# EAGLE schematic board (EAGLE 9.5.1)
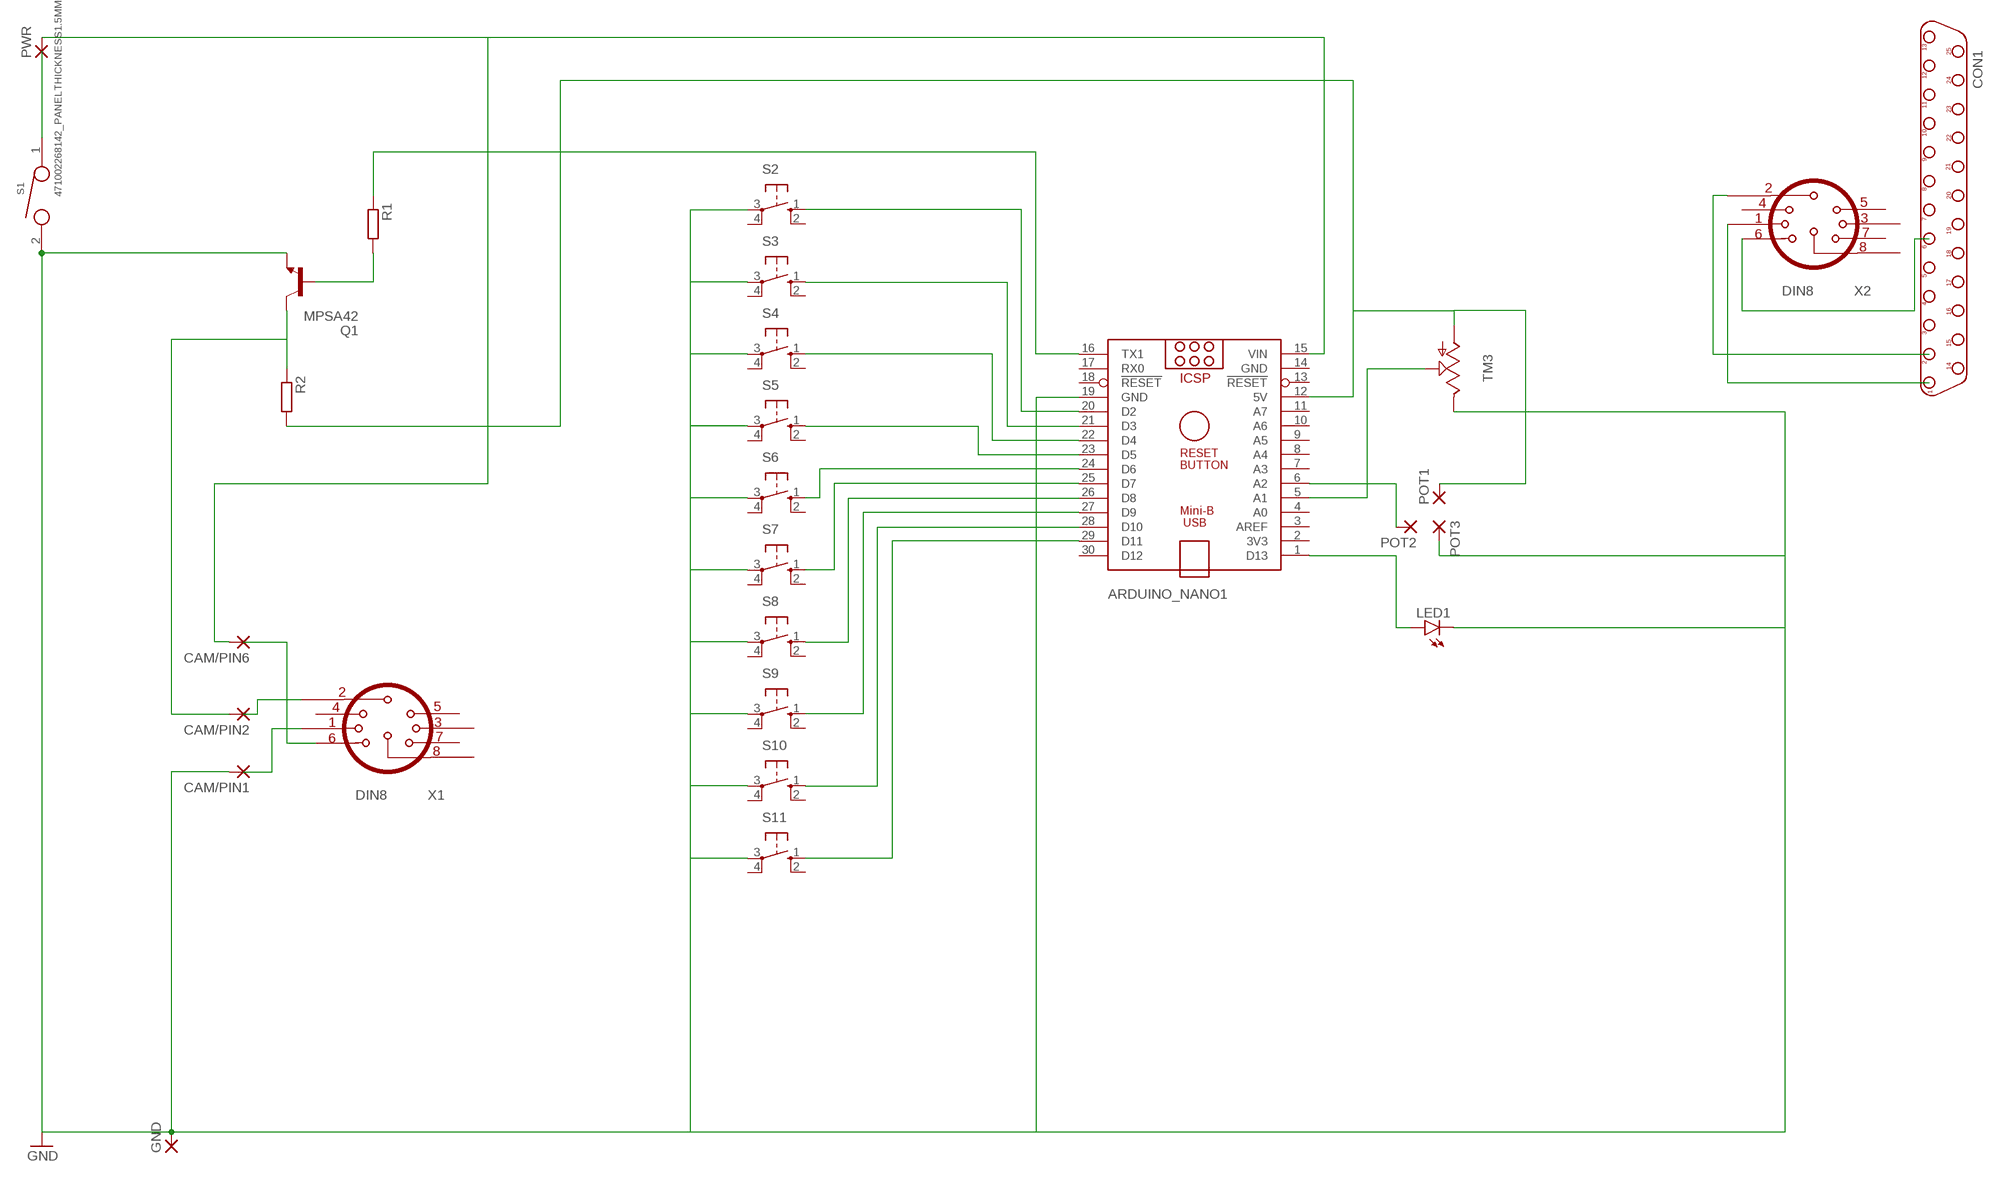
[diagram p0: schematic, sheet 1]

## Parts
ARDUINO_NANO1  ARDUINO_NANO  [ARDUINO_NANO]
CAM/PIN1  1,6/0,8  [1,6/0,8]
CAM/PIN2  1,6/0,8  [1,6/0,8]
CAM/PIN6  1,6/0,8  [1,6/0,8]
CON1  DB25F  [D-25F]
GND  1,6/0,8  [1,6/0,8]
LED1  LED5MM  [LED5MM]
POT1  1,6/0,8  [1,6/0,8]
POT2  1,6/0,8  [1,6/0,8]
POT3  1,6/0,8  [1,6/0,8]
PWR  1,6/0,8  [1,6/0,8]
Q1  MPSA42  [TO92]
R1  R-EU_0204/2V  [0204V]
R2  R-EU_0204/2V  [0204V]
S1  471002268142_PANELTHICKNESS1.5MM  [47100226814X_PANELTHICKNESS1.5MM]
S2  10-XX  [B3F-10XX]
S3  10-XX  [B3F-10XX]
S4  10-XX  [B3F-10XX]
S5  10-XX  [B3F-10XX]
S6  10-XX  [B3F-10XX]
S7  10-XX  [B3F-10XX]
S8  10-XX  [B3F-10XX]
S9  10-XX  [B3F-10XX]
S10  10-XX  [B3F-10XX]
S11  10-XX  [B3F-10XX]
TM3  TRIMSLIDE75  [SLIDEPOT-75]
X1  DIN8  [DIN8]
X2  DIN8  [DIN8]

## Nets
GND [ground]: ARDUINO_NANO1.19(GND) CAM/PIN1.1(P) GND.1(P) LED1.K(C) POT3.1(P) Q1.3(E) S1.2 S2.3(P) S3.3(P) S4.3(P) S5.3(P) S6.3(P) S7.3(P) S8.3(P) S9.3(P) S10.3(P) S11.3(P) TM3.B
N$1: X1.P$7
N$2: ARDUINO_NANO1.12(5V) POT1.1(P) R2.2 TM3.A
N$3: ARDUINO_NANO1.20(D2) S2.1(S)
N$4: ARDUINO_NANO1.21(D3) S3.1(S)
N$5: ARDUINO_NANO1.22(D4) S4.1(S)
N$6: ARDUINO_NANO1.23(D5) S5.1(S)
N$7: ARDUINO_NANO1.24(D6) S6.1(S)
N$8: ARDUINO_NANO1.25(D7) S7.1(S)
N$9: ARDUINO_NANO1.26(D8) S8.1(S)
N$10: ARDUINO_NANO1.27(D9) S9.1(S)
N$11: ARDUINO_NANO1.28(D10) S10.1(S)
N$12: ARDUINO_NANO1.29(D11) S11.1(S)
N$13: ARDUINO_NANO1.15(VIN) CAM/PIN6.1(P) PWR.1(P)
N$14: ARDUINO_NANO1.16(TX1) R1.1
N$15: Q1.2(B) R1.2
N$16: ARDUINO_NANO1.5(A1) TM3.WIPER
N$17: ARDUINO_NANO1.6(A2) POT2.1(P)
N$18: CAM/PIN2.1(P) Q1.1(C) R2.1
N$19: ARDUINO_NANO1.1(D13) LED1.A
N$20: X1.P$2
N$21: X1.P$1
N$22: CON1.2 X2.P$2
N$23: CON1.6 X2.P$7
N$24: CON1.1 X2.P$1
N$25: S1.1
Unconnected: ARDUINO_NANO1.2(3V3) ARDUINO_NANO1.3(AREF) ARDUINO_NANO1.4(A0) ARDUINO_NANO1.7(A3) ARDUINO_NANO1.8(A4) ARDUINO_NANO1.9(A5) ARDUINO_NANO1.10(A6) ARDUINO_NANO1.11(A7) ARDUINO_NANO1.13(!RESET) ARDUINO_NANO1.17(RX0) ARDUINO_NANO1.18(!RESET) ARDUINO_NANO1.30(D12) CON1.3 CON1.4 CON1.5 CON1.7 CON1.8 CON1.9 CON1.10 CON1.11 CON1.12 CON1.13 CON1.14 CON1.15 CON1.16 CON1.17 CON1.18 CON1.19 CON1.20 CON1.21 CON1.22 CON1.23 CON1.24 CON1.25 S2.2(S1) S2.4(P1) S3.2(S1) S3.4(P1) S4.2(S1) S4.4(P1) S5.2(S1) S5.4(P1) S6.2(S1) S6.4(P1) S7.2(S1) S7.4(P1) S8.2(S1) S8.4(P1) S9.2(S1) S9.4(P1) S10.2(S1) S10.4(P1) S11.2(S1) S11.4(P1) X1.P$3 X1.P$4 X1.P$5 X1.P$6 X1.P$8 X2.P$3 X2.P$4 X2.P$5 X2.P$6 X2.P$8

## Power pins joined to a net without a drawn wire
GND: ARDUINO_NANO1.14(GND)

## Library data of the parts
ARDUINO_NANO1 = ArduinoNanoV30:ARDUINO_NANO: Arduino Nano V3.0 Overview: The Arduino Nano is a small, complete, and breadboard-friendly board based on the ATmega328 (Arduino Nano 3.x) or ATmega168 (Arduino Nano 2.x). It has more or less the same functionality of the Arduino Duemilanove, but in a different package. It lacks only a DC power jack, and works with a Mini-B USB cable instead of a standard one. The Nano was designed and is being produced by Gravitech. Specifications: Microcontroller Atmel ATmega168 or ATmega328 Operating Voltage (logic level) 5 V Input Voltage (recommended) 7-12 V Input Voltage (limits) 6-20 V Digital I/O Pins 14 (of which 6 provide PWM output) Analog Input Pins 8 DC Current per I/O Pin 40 mA Flash Memory 16 KB (ATmega168) or 32 KB (ATmega328) of which 2 KB used by bootloader SRAM 1 KB (ATmega168) or 2 KB (ATmega328) EEPROM 512 bytes (ATmega168) or 1 KB (ATmega328) Clock Speed 16 MHz Dimensions 0.73" x 1.70" Length 45 mm Width 18 mm Weigth 5 g Power: The Arduino Nano can be powered via the Mini-B USB connection, 6-20V unregulated external power supply (pin 30), or 5V regulated external power supply (pin 27). The power source is automatically selected to the highest voltage source. Memory: The ATmega168 has 16 KB of flash memory for storing code (of which 2 KB is used for the bootloader); the ATmega328 has 32 KB, (also with 2 KB used for the bootloader). The ATmega168 has 1 KB of SRAM and 512 bytes of EEPROM (which can be read and written with the EEPROM library); the ATmega328 has 2 KB of SRAM and 1 KB of EEPROM. Input and Output: Each of the 14 digital pins on the Nano can be used as an input or output, using pinMode(), digitalWrite(), and digitalRead() functions. They operate at 5 volts. Each pin can provide or receive a maximum of 40 mA and has an internal pull-up resistor (disconnected by default) of 20-50 kOhms. In addition, some pins have specialized functions. Visit Arduino - ArduinoBoardNano <https://www.arduino.cc/en/Main/ArduinoBoardNano>
CAM/PIN1 CAM/PIN2 CAM/PIN6 GND POT1-POT3 PWR = wirepad:1,6/0,8: THROUGH-HOLE PAD
CON1 = db25:DB25F
LED1 = led:LED: LED OSRAM: - CHIPLED LG R971, LG N971, LY N971, LG Q971, LY Q971, LO R971, LY R971 LH N974, LH R974 LS Q976, LO Q976, LY Q976 LO Q996 - Hyper CHIPLED LW Q18S LB Q993, LB Q99A, LB R99A - SideLED LS A670, LO A670, LY A670, LG A670, LP A670 LB A673, LV A673, LT A673, LW A673 LH A674 LY A675 LS A676, LA A676, LO A676, LY A676, LW A676 LS A679, LY A679, LG A679 - Hyper Micro SIDELED® LS Y876, LA Y876, LO Y876, LY Y876 LT Y87S - SmartLED LW L88C, LW L88S LB L89C, LB L89S, LG L890 LS L89K, LO L89K, LY L89K LS L896, LA L896, LO L896, LY L896 - TOPLED LS T670, LO T670, LY T670, LG T670, LP T670 LSG T670, LSP T670, LSY T670, LOP T670, LYG T670 LG T671, LOG T671, LSG T671 LB T673, LV T673, LT T673, LW T673 LH T674 LS T676, LA T676, LO T676, LY T676, LB T676, LH T676, LSB T676, LW T676 LB T67C, LV T67C, LT T67C, LS T67K, LO T67K, LY T67K, LW E67C LS E67B, LA E67B, LO E67B, LY E67B, LB E67C, LV E67C, LT E67C LW T67C LS T679, LY T679, LG T679 LS T770, LO T770, LY T770, LG T770, LP T770 LB T773, LV T773, LT T773, LW T773 LH T774 LS E675, LA E675, LY E675, LS T675 LS T776, LA T776, LO T776, LY T776, LB T776 LHGB T686 LT T68C, LB T68C - Hyper Mini TOPLED® LB M676 - Mini TOPLED Santana® LG M470 LS M47K, LO M47K, LY M47K Source: http://www.osram.convergy.de LUXEON: - LUMILED® LXK2-PW12-R00, LXK2-PW12-S00, LXK2-PW14-U00, LXK2-PW14-V00 LXK2-PM12-R00, LXK2-PM12-S00, LXK2-PM14-U00 LXK2-PE12-Q00, LXK2-PE12-R00, LXK2-PE12-S00, LXK2-PE14-T00, LXK2-PE14-U00 LXK2-PB12-K00, LXK2-PB12-L00, LXK2-PB12-M00, LXK2-PB14-N00, LXK2-PB14-P00, LXK2-PB14-Q00 LXK2-PR12-L00, LXK2-PR12-M00, LXK2-PR14-Q00, LXK2-PR14-R00 LXK2-PD12-Q00, LXK2-PD12-R00, LXK2-PD12-S00 LXK2-PH12-R00, LXK2-PH12-S00 LXK2-PL12-P00, LXK2-PL12-Q00, LXK2-PL12-R00 Source: www.luxeon.com KINGBRIGHT: KA-3528ASYC Source: www.kingbright.com
Q1 = MPSA42:MPSA42: NPN TRANSISTOR; AVAILABILITY: Unavailable; DESCRIPTION: TRANSISTOR, NPN, TO-92; Transistor Type: Bipolar; Transistor Polarity: NPN; Collector-to-Emitter Breakdown Voltage: 3...; MF: Central Semiconductor; MP: MPSA42; PACKAGE: TO-92 Multicomp; PRICE: None
R1 R2 = rcl:R-EU_: RESISTOR, European symbol; SPICEPREFIX: R
S1 = power_switch:471002268142: Ø 20.2 mm panel Cut-out with 0.187’’ quick connect terminal Rocker Switch WS-RSTV MATERIAL PROPERTIES: Actuator Material PA66 Actuator Flammability Rating UL94 V-2 Actuator Color Black Frame Material PA66 Frame Flammability Rating UL94 V-2 Frame Color Black Spring Material Carbon Steel Spring Holder Material Copper Alloy Moveable Contactor Material Copper Alloy Moveable Contactor Plating Silver Moveable Contact Material Copper Alloy Moveable Contact Plating Silver Stationary Contact Copper Alloy Stationary Contact Plating Silver Terminal Material Copper Alloy Terminal Plating Silver ELECTRICAL PROPERTIES: IR 1 10 A IR 4 A Inrush Current Motor Load (Value) 24 A UR 1 250 V (AC) IR 2 20 A UR 2 14 V (DC) IR 3 10 A UR 3 28 V (DC) Contact Resistance 50 mΩ RISO 100 MΩ Dielectric strength Pin to Pin 1500 V (AC) Dielectric strength Pin to Case 3000 V (AC) MECHANICAL PROPERTIES: Force (OFF to ON) 1100 g Life Cycle 10000 Cycles Schematic SPST GENERAL INFORMATION: Operating Temperature 0 °C up to +85 °C Storage Temperature (in original packaging) 0 °C up to +85 °C PACKAGING PROPERTIES: Packaging Tray Qty. 100 Switch Position Off COMPLIES WITH: UL Approval E483308 ENEC Approval ENEC-01833 CQC Approval CQC17002183995 <http://katalog.we-online.de/media/images/v2/Family_WS-RSTV_471002xxxxxx.jpg> Details see: http://katalog.we-online.de/em/datasheet/471002268142.pdf Created By Yingchun Shan 2018-06-05 2018 (C) Wurth Elektronik; AVAILABILITY: Unavailable; DESCRIPTION: Rocker Switch SPST 10A _AC/DC_ 250V Panel Mount, Snap-In; MF: Würth Elektronik; MP: 471002268142; PACKAGE: None; PRICE: None
S2-S11 = switch-omron:10-XX: OMRON SWITCH; MPN: B3F-1000; OC_FARNELL: 176432; OC_NEWARK: 36M3542
TM3 = Bourns PTA series:TRIM: Sliding potentiometers Based on Adafruits (https://github.com/adafruit/Adafruit-Eagle-Library) 'TRIM' device. For Bourns PTA series and TT Electronics PSxx series potentiometers.
X1 X2 = con-din8:DIN8: Female CONNECTOR 8 pins with shield, horizontal (DIN 41524)

## Net classes
0 default: width 0.406 mm, clearance 0.406 mm
1 ground: width 0.61 mm, clearance 0.61 mm